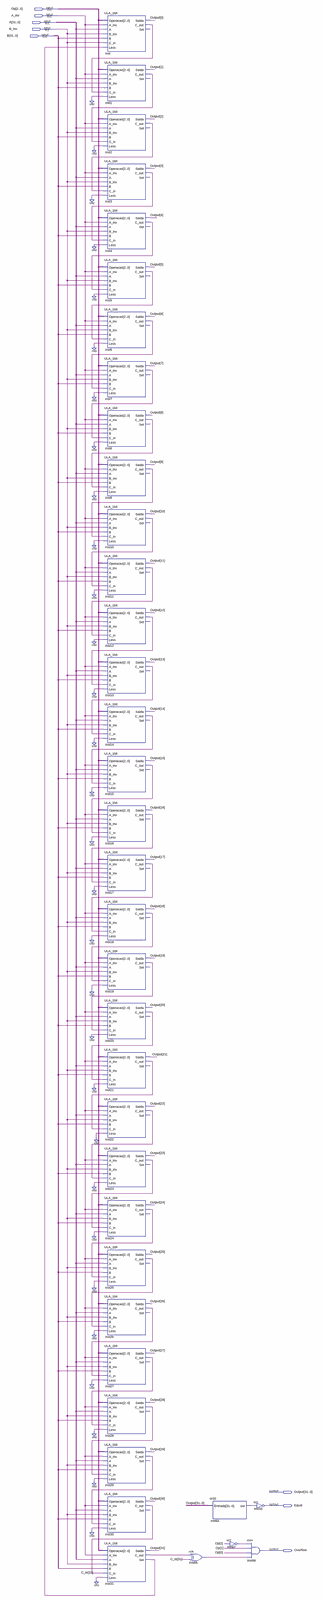
[diagram p0: schematic sheet, whole]
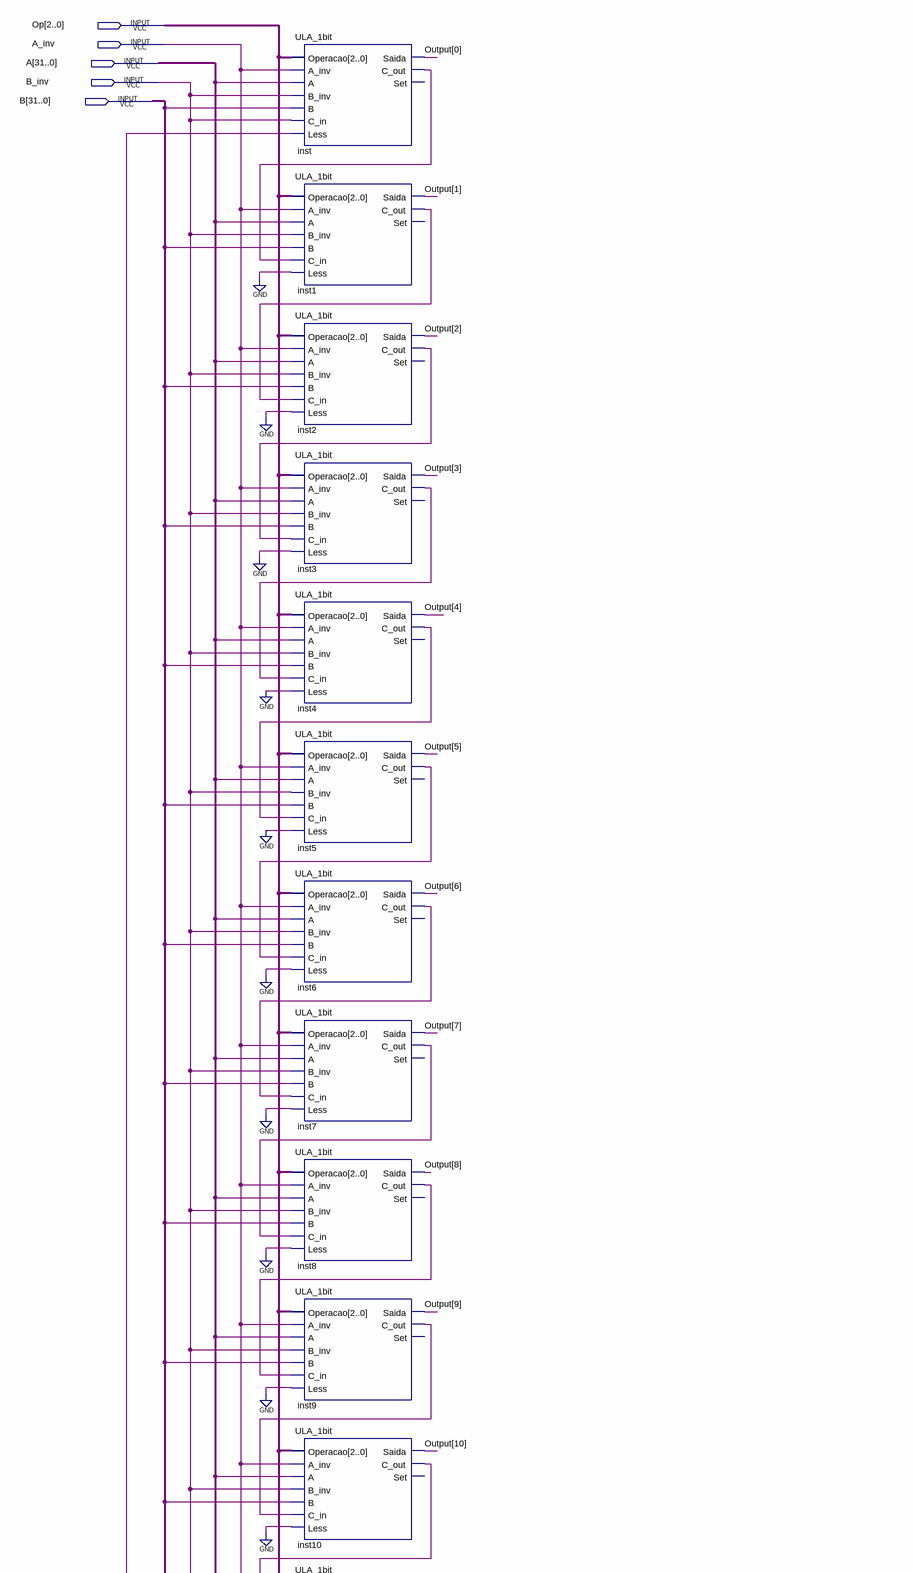
[diagram p1: schematic sheet, upper part]
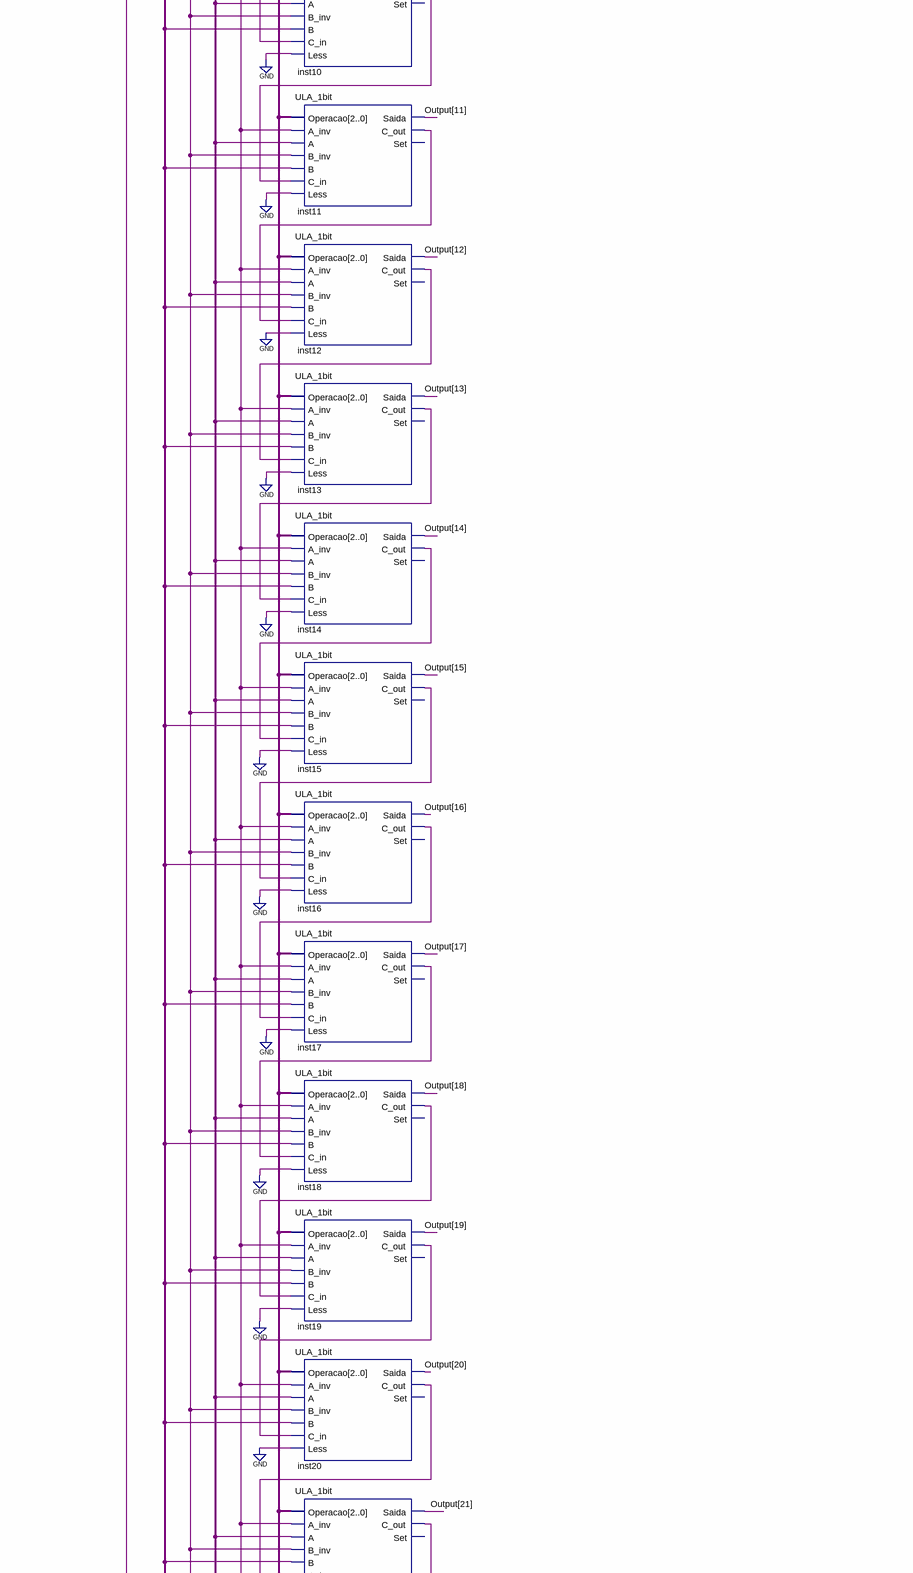
[diagram p2: schematic sheet, middle part]
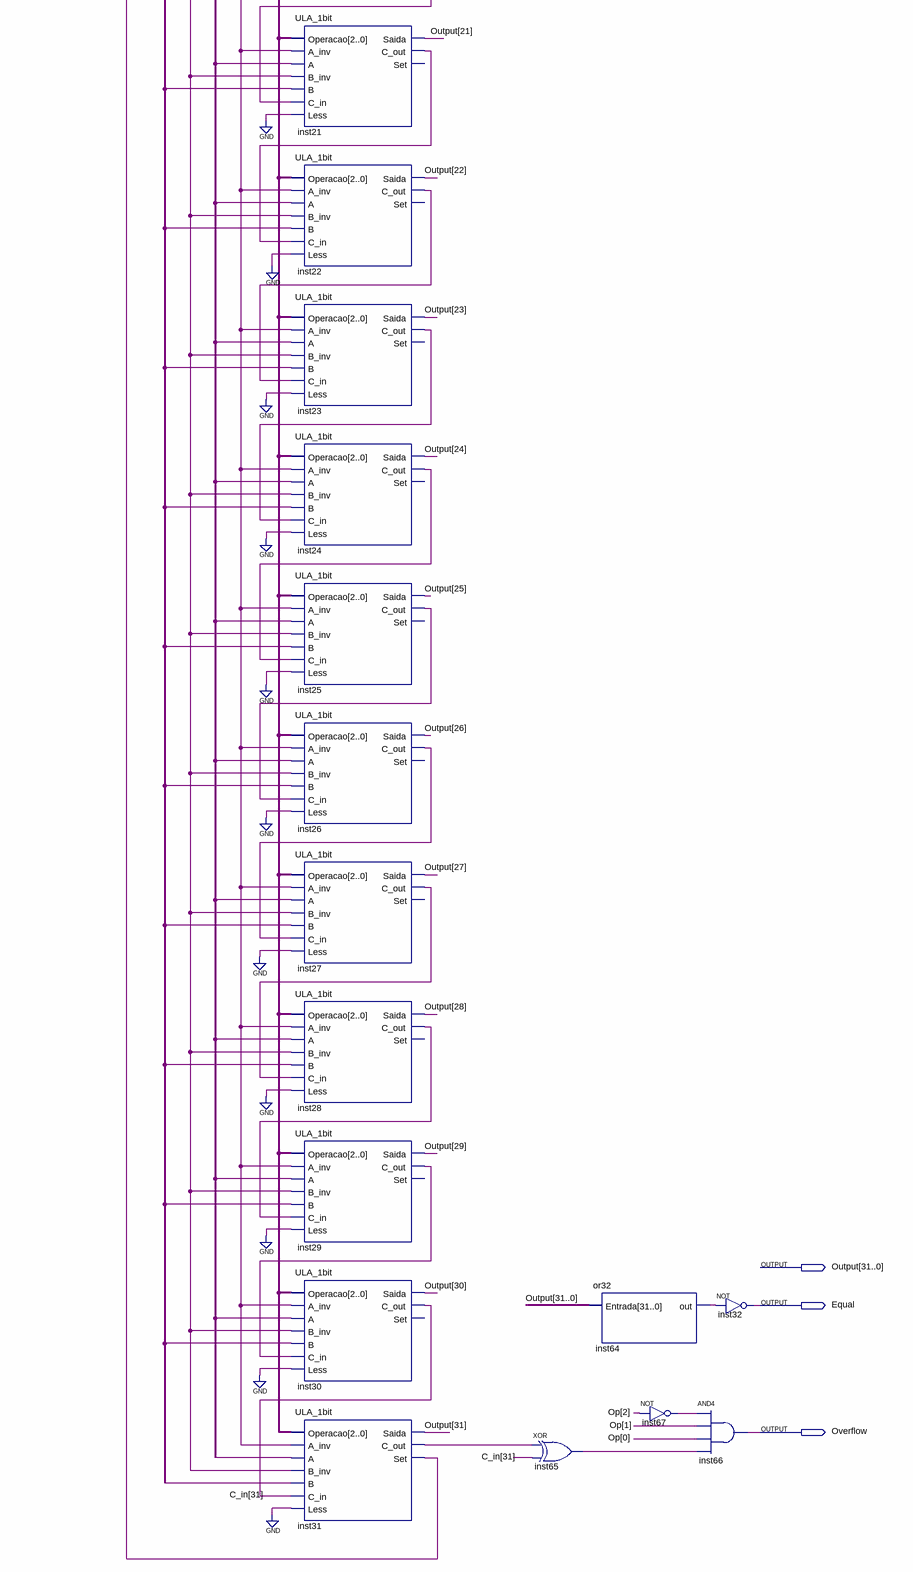
[diagram p3: schematic sheet, lower part]
// Quartus schematic ULA_32bits.bdf as structural Verilog: 37 symbols, 8 pins
module ULA_32bits (
  input  [2:0] Op,
  input  A_inv,
  input  [31:0] A,
  input  B_inv,
  input  [31:0] B,
  output [31:0] Output,
  output Equal,
  output Overflow
);

  wire inst1_c_out, inst2_c_out, inst3_c_out, inst4_c_out, inst5_c_out, inst6_c_out, inst7_c_out,
       inst8_c_out, inst9_c_out, inst10_c_out, inst11_c_out, inst12_c_out, inst13_c_out, inst14_c_out,
       inst15_c_out, inst16_c_out, inst17_c_out, inst18_c_out, inst19_c_out, inst20_c_out, inst21_c_out,
       inst22_c_out, inst23_c_out, inst24_c_out, inst25_c_out, inst26_c_out, inst27_c_out, inst28_c_out,
       inst29_c_out, inst31_c_out, inst31_set, inst64_out, inst65_out, inst67_out, inst_c_out;
  wire [31:31] C_in;

  ULA_1bit inst (
    .Operacao(Op), .A_inv(A_inv), .A(A[0]), .B_inv(B_inv), .B(B[0]), .C_in(B_inv), .Less(inst31_set),
    .Saida(Output[0]), .C_out(inst_c_out));  // open: Set
  ULA_1bit inst1 (
    .Operacao(Op), .A_inv(A_inv), .A(A[1]), .B_inv(B_inv), .B(B[1]), .C_in(inst_c_out), .Less(1'b0),
    .Saida(Output[1]), .C_out(inst1_c_out));  // open: Set
  ULA_1bit inst2 (
    .Operacao(Op), .A_inv(A_inv), .A(A[2]), .B_inv(B_inv), .B(B[2]), .C_in(inst1_c_out), .Less(1'b0),
    .Saida(Output[2]), .C_out(inst2_c_out));  // open: Set
  ULA_1bit inst3 (
    .Operacao(Op), .A_inv(A_inv), .A(A[3]), .B_inv(B_inv), .B(B[3]), .C_in(inst2_c_out), .Less(1'b0),
    .Saida(Output[3]), .C_out(inst3_c_out));  // open: Set
  ULA_1bit inst4 (
    .Operacao(Op), .A_inv(A_inv), .A(A[4]), .B_inv(B_inv), .B(B[4]), .C_in(inst3_c_out), .Less(1'b0),
    .Saida(Output[4]), .C_out(inst4_c_out));  // open: Set
  ULA_1bit inst5 (
    .Operacao(Op), .A_inv(A_inv), .A(A[5]), .B_inv(B_inv), .B(B[5]), .C_in(inst4_c_out), .Less(1'b0),
    .Saida(Output[5]), .C_out(inst5_c_out));  // open: Set
  ULA_1bit inst6 (
    .Operacao(Op), .A_inv(A_inv), .A(A[6]), .B_inv(B_inv), .B(B[6]), .C_in(inst5_c_out), .Less(1'b0),
    .Saida(Output[6]), .C_out(inst6_c_out));  // open: Set
  ULA_1bit inst7 (
    .Operacao(Op), .A_inv(A_inv), .A(A[7]), .B_inv(B_inv), .B(B[7]), .C_in(inst6_c_out), .Less(1'b0),
    .Saida(Output[7]), .C_out(inst7_c_out));  // open: Set
  ULA_1bit inst8 (
    .Operacao(Op), .A_inv(A_inv), .A(A[8]), .B_inv(B_inv), .B(B[8]), .C_in(inst7_c_out), .Less(1'b0),
    .Saida(Output[8]), .C_out(inst8_c_out));  // open: Set
  ULA_1bit inst9 (
    .Operacao(Op), .A_inv(A_inv), .A(A[9]), .B_inv(B_inv), .B(B[9]), .C_in(inst8_c_out), .Less(1'b0),
    .Saida(Output[9]), .C_out(inst9_c_out));  // open: Set
  ULA_1bit inst10 (
    .Operacao(Op), .A_inv(A_inv), .A(A[10]), .B_inv(B_inv), .B(B[10]), .C_in(inst9_c_out), .Less(1'b0),
    .Saida(Output[10]), .C_out(inst10_c_out));  // open: Set
  ULA_1bit inst11 (
    .Operacao(Op), .A_inv(A_inv), .A(A[11]), .B_inv(B_inv), .B(B[11]), .C_in(inst10_c_out), .Less(1'b0),
    .Saida(Output[11]), .C_out(inst11_c_out));  // open: Set
  ULA_1bit inst12 (
    .Operacao(Op), .A_inv(A_inv), .A(A[12]), .B_inv(B_inv), .B(B[12]), .C_in(inst11_c_out), .Less(1'b0),
    .Saida(Output[12]), .C_out(inst12_c_out));  // open: Set
  ULA_1bit inst13 (
    .Operacao(Op), .A_inv(A_inv), .A(A[13]), .B_inv(B_inv), .B(B[13]), .C_in(inst12_c_out), .Less(1'b0),
    .Saida(Output[13]), .C_out(inst13_c_out));  // open: Set
  ULA_1bit inst14 (
    .Operacao(Op), .A_inv(A_inv), .A(A[14]), .B_inv(B_inv), .B(B[14]), .C_in(inst13_c_out), .Less(1'b0),
    .Saida(Output[14]), .C_out(inst14_c_out));  // open: Set
  ULA_1bit inst15 (
    .Operacao(Op), .A_inv(A_inv), .A(A[15]), .B_inv(B_inv), .B(B[15]), .C_in(inst14_c_out), .Less(1'b0),
    .Saida(Output[15]), .C_out(inst15_c_out));  // open: Set
  ULA_1bit inst16 (
    .Operacao(Op), .A_inv(A_inv), .A(A[16]), .B_inv(B_inv), .B(B[16]), .C_in(inst15_c_out), .Less(1'b0),
    .Saida(Output[16]), .C_out(inst16_c_out));  // open: Set
  ULA_1bit inst17 (
    .Operacao(Op), .A_inv(A_inv), .A(A[17]), .B_inv(B_inv), .B(B[17]), .C_in(inst16_c_out), .Less(1'b0),
    .Saida(Output[17]), .C_out(inst17_c_out));  // open: Set
  ULA_1bit inst18 (
    .Operacao(Op), .A_inv(A_inv), .A(A[18]), .B_inv(B_inv), .B(B[18]), .C_in(inst17_c_out), .Less(1'b0),
    .Saida(Output[18]), .C_out(inst18_c_out));  // open: Set
  ULA_1bit inst19 (
    .Operacao(Op), .A_inv(A_inv), .A(A[19]), .B_inv(B_inv), .B(B[19]), .C_in(inst18_c_out), .Less(1'b0),
    .Saida(Output[19]), .C_out(inst19_c_out));  // open: Set
  ULA_1bit inst20 (
    .Operacao(Op), .A_inv(A_inv), .A(A[20]), .B_inv(B_inv), .B(B[20]), .C_in(inst19_c_out), .Less(1'b0),
    .Saida(Output[20]), .C_out(inst20_c_out));  // open: Set
  ULA_1bit inst21 (
    .Operacao(Op), .A_inv(A_inv), .A(A[21]), .B_inv(B_inv), .B(B[21]), .C_in(inst20_c_out), .Less(1'b0),
    .Saida(Output[21]), .C_out(inst21_c_out));  // open: Set
  ULA_1bit inst22 (
    .Operacao(Op), .A_inv(A_inv), .A(A[22]), .B_inv(B_inv), .B(B[22]), .C_in(inst21_c_out), .Less(1'b0),
    .Saida(Output[22]), .C_out(inst22_c_out));  // open: Set
  ULA_1bit inst23 (
    .Operacao(Op), .A_inv(A_inv), .A(A[23]), .B_inv(B_inv), .B(B[23]), .C_in(inst22_c_out), .Less(1'b0),
    .Saida(Output[23]), .C_out(inst23_c_out));  // open: Set
  ULA_1bit inst24 (
    .Operacao(Op), .A_inv(A_inv), .A(A[24]), .B_inv(B_inv), .B(B[24]), .C_in(inst23_c_out), .Less(1'b0),
    .Saida(Output[24]), .C_out(inst24_c_out));  // open: Set
  ULA_1bit inst25 (
    .Operacao(Op), .A_inv(A_inv), .A(A[25]), .B_inv(B_inv), .B(B[25]), .C_in(inst24_c_out), .Less(1'b0),
    .Saida(Output[25]), .C_out(inst25_c_out));  // open: Set
  ULA_1bit inst26 (
    .Operacao(Op), .A_inv(A_inv), .A(A[26]), .B_inv(B_inv), .B(B[26]), .C_in(inst25_c_out), .Less(1'b0),
    .Saida(Output[26]), .C_out(inst26_c_out));  // open: Set
  ULA_1bit inst27 (
    .Operacao(Op), .A_inv(A_inv), .A(A[27]), .B_inv(B_inv), .B(B[27]), .C_in(inst26_c_out), .Less(1'b0),
    .Saida(Output[27]), .C_out(inst27_c_out));  // open: Set
  ULA_1bit inst28 (
    .Operacao(Op), .A_inv(A_inv), .A(A[28]), .B_inv(B_inv), .B(B[28]), .C_in(inst27_c_out), .Less(1'b0),
    .Saida(Output[28]), .C_out(inst28_c_out));  // open: Set
  ULA_1bit inst29 (
    .Operacao(Op), .A_inv(A_inv), .A(A[29]), .B_inv(B_inv), .B(B[29]), .C_in(inst28_c_out), .Less(1'b0),
    .Saida(Output[29]), .C_out(inst29_c_out));  // open: Set
  ULA_1bit inst30 (
    .Operacao(Op), .A_inv(A_inv), .A(A[30]), .B_inv(B_inv), .B(B[30]), .C_in(inst29_c_out), .Less(1'b0),
    .Saida(Output[30]), .C_out(C_in[31]));  // open: Set
  ULA_1bit inst31 (
    .Operacao(Op), .A_inv(A_inv), .A(A[31]), .B_inv(B_inv), .B(B[31]), .C_in(C_in[31]), .Less(1'b0),
    .Saida(Output[31]), .C_out(inst31_c_out), .Set(inst31_set));
  xor inst65 (inst65_out, inst31_c_out, C_in[31]);
  or32 inst64 (.Entrada(Output), .out(inst64_out));
  not inst67 (inst67_out, Op[2]);
  not inst32 (Equal, inst64_out);
  and inst66 (Overflow, inst67_out, Op[1], Op[0], inst65_out);
endmodule
